# EAGLE schematic MainHub (EAGLE 7.6.0)
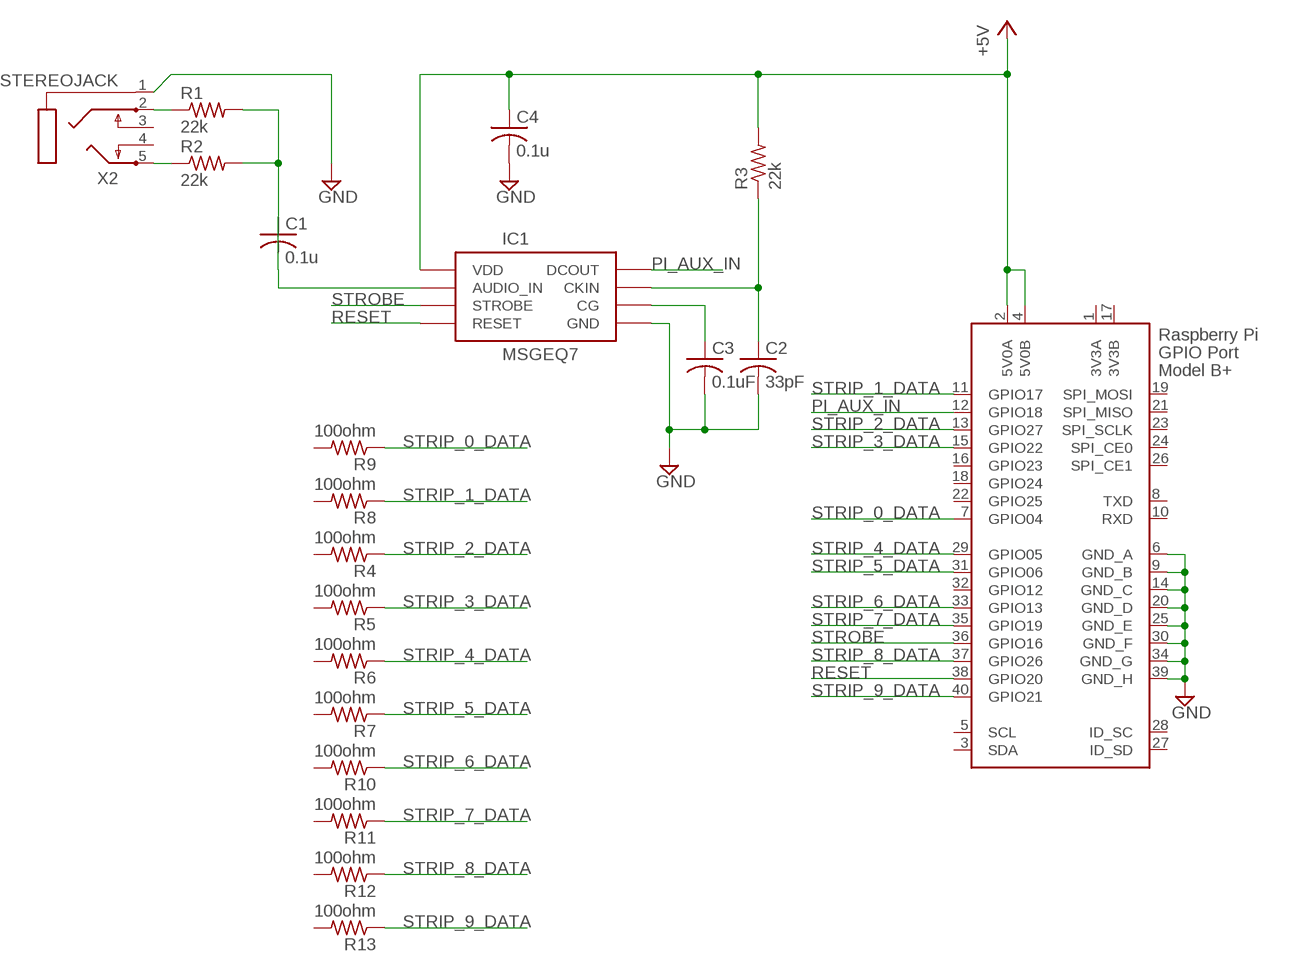
[diagram p0: schematic, sheet 1]

## Parts
C1  0.1u  C-USC0402  [C0402]
C2  33pF  C-USC0402  [C0402]
C3  0.1uF  C-USC0402  [C0402]
C4  0.1u  C-USC0402  [C0402]
IC1  MSGEQ7SOIC  [SOIC8]
R1  22k  R-US_R0402  [R0402]
R2  22k  R-US_R0402  [R0402]
R3  22k  R-US_R0402  [R0402]
R4  100ohm  R-US_R0402  [R0402]
R5  100ohm  R-US_R0402  [R0402]
R6  100ohm  R-US_R0402  [R0402]
R7  100ohm  R-US_R0402  [R0402]
R8  100ohm  R-US_R0402  [R0402]
R9  100ohm  R-US_R0402  [R0402]
R10  100ohm  R-US_R0402  [R0402]
R11  100ohm  R-US_R0402  [R0402]
R12  100ohm  R-US_R0402  [R0402]
R13  100ohm  R-US_R0402  [R0402]
X1  RASPI_GPIO_B+#_BOX  [RASPI_GPIO_B+_BOX]
X2  STEREOJACK  [STX3100]

## Nets
+5V: C4.1 IC1.1(VDD) R3.2 X1.2(5V0A) X1.4(5V0B)
GND: C2.2 C3.2 C4.2 IC1.2(GND) X1.6(GND_A) X1.9(GND_B) X1.14(GND_C) X1.20(GND_D) X1.25(GND_E) X1.30(GND_F) X1.34(GND_G) X1.39(GND_H) X2.1
N$1: C3.1 IC1.6(CG)
N$2: C1.1 C1.2 IC1.5(AUDIO_IN) R1.2 R2.2
N$3: R2.1 X2.5
N$4: C2.1 IC1.8(CKIN) R3.1
N$5: R1.1 X2.2
PI_AUX_IN: IC1.3(DCOUT) X1.12(GPIO18)
RESET: IC1.7(RESET) X1.38(GPIO20)
STRIP_0_DATA: R9.1 X1.7(GPIO04)
STRIP_1_DATA: R8.1 X1.11(GPIO17)
STRIP_2_DATA: R4.1 X1.13(GPIO27)
STRIP_3_DATA: R5.1 X1.15(GPIO22)
STRIP_4_DATA: R6.1 X1.29(GPIO05)
STRIP_5_DATA: R7.1 X1.31(GPIO06)
STRIP_6_DATA: R10.1 X1.33(GPIO13)
STRIP_7_DATA: R11.1 X1.35(GPIO19)
STRIP_8_DATA: R12.1 X1.37(GPIO26)
STRIP_9_DATA: R13.1 X1.40(GPIO21)
STROBE: IC1.4(STROBE) X1.36(GPIO16)
Unconnected: R4.2 R5.2 R6.2 R7.2 R8.2 R9.2 R10.2 R11.2 R12.2 R13.2 X1.3(SDA) X1.5(SCL) X1.8(TXD) X1.10(RXD) X1.16(GPIO23) X1.18(GPIO24) X1.19(SPI_MOSI) X1.21(SPI_MISO) X1.22(GPIO25) X1.23(SPI_SCLK) X1.24(SPI_CE0) X1.26(SPI_CE1) X1.27(ID_SD) X1.28(ID_SC) X1.32(GPIO12) X2.3 X2.4

## Power pins joined to a net without a drawn wire
3V3A: X1.1(3V3A)
3V3B: X1.17(3V3B)

## Library data of the parts
C1-C4 = rcl:C-US: CAPACITOR, American symbol
IC1 = msgeq7:MSGEQ7: 7-band graphic equalizer
R1-R13 = rcl:R-US_: RESISTOR, American symbol
X1 = raspberrypi_bastelstube_v13:RASPI_GPIO_B+#: 2x20 header connector, all pins connected
X2 = adafruit:STEREOJACK: MIC/HEADPHONE JACK Stereo jack with two switches. Kycon STX3100, CUI SJ1-3555NG and/or 4UCon 05544